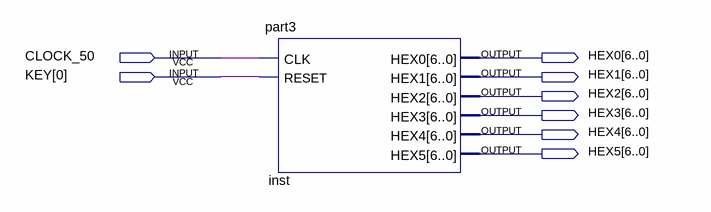
[diagram p0: schematic sheet]
// Quartus schematic part3_sch.bdf as structural Verilog: 1 symbols, 8 pins
module part3_sch (
  input  CLOCK_50,
  input  [0:0] KEY,
  output [6:0] HEX0,
  output [6:0] HEX1,
  output [6:0] HEX2,
  output [6:0] HEX3,
  output [6:0] HEX4,
  output [6:0] HEX5
);

  part3 inst (
    .CLK(CLOCK_50), .RESET(KEY[0]), .HEX0(HEX0), .HEX1(HEX1), .HEX2(HEX2), .HEX3(HEX3), .HEX4(HEX4),
    .HEX5(HEX5));
endmodule
